# EAGLE schematic Proximity_sensor_v2 (EAGLE 9.2.0)
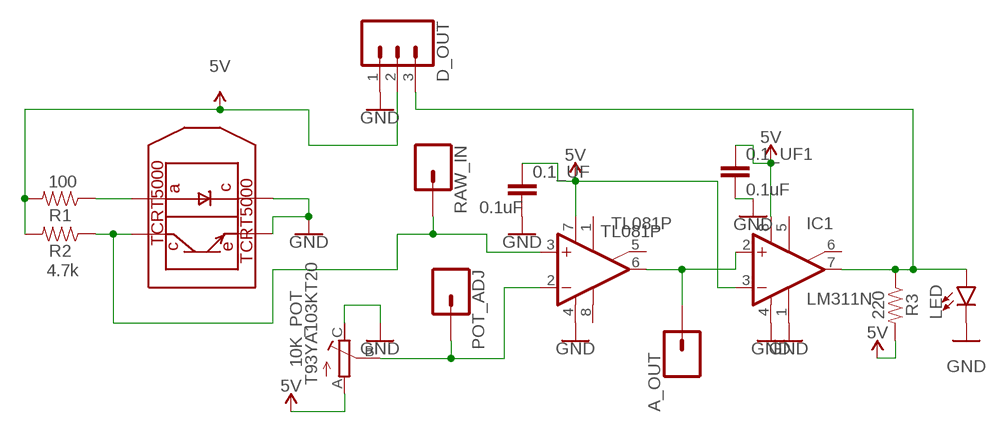
[diagram p0: schematic, sheet 1]

## Parts
0.1_UF  0.1uF  0.1UF-KIT-EZ-50V-20%  [CAP-PTH-SMALL-KIT]
0.1_UF1  0.1uF  0.1UF-KIT-EZ-50V-20%  [CAP-PTH-SMALL-KIT]
10K_POT  T93YA103KT20  [TRIM_T93YA103KT20]
A_OUT  CONN_01  [1X01]
D_OUT  CONN_03  [1X03]
IC1  LM311N  [DIL08]
LED  LED5MM  [LED_5MM]
POT_ADJ  CONN_01  [1X01]
R1  100  RESISTORAXIAL-0.3-KIT  [AXIAL-0.3-KIT]
R2  4.7k  RESISTORAXIAL-0.3-KIT  [AXIAL-0.3-KIT]
R3  220  RESISTORAXIAL-0.3-KIT  [AXIAL-0.3-KIT]
RAW_IN  CONN_01  [1X01]
TCRT5000  TCRT5000  [5000]
TL081P  TL081P  [DIL08]

## Nets
5V: 0.1_UF1.1 0.1_UF.1 10K_POT.A D_OUT.2 IC1.3(-IN) IC1.8(V+) R1.P$2 R2.P$2 R3.P$2 TL081P.7(V+)
A_OUT: A_OUT.1 IC1.2(+IN) TL081P.6(OUT)
GND: 0.1_UF1.2 0.1_UF.2 10K_POT.C D_OUT.1 IC1.1(GND) IC1.4(V-) LED.K(C) TCRT5000.P$2 TCRT5000.P$4 TL081P.4(V-)
OUTPUT: D_OUT.3 IC1.7(OUT) LED.A R3.P$1
RAW: R2.P$1 RAW_IN.1 TCRT5000.P$1 TL081P.3(+IN)
REF: 10K_POT.B POT_ADJ.1 TL081P.2(-IN)
SOURCING: R1.P$1 TCRT5000.P$3
Unconnected: IC1.5(ON) IC1.6(ON/STR) TL081P.1(ON1) TL081P.5(ON2) TL081P.8(OPT)

## Library data of the parts
0.1_UF 0.1_UF1 = SparkFun-Capacitors:0.1UF: 0.1µF ceramic capacitors A capacitor is a passive two-terminal electrical component used to store electrical energy temporarily in an electric field.; PROD_ID: CAP-08370
10K_POT = Pot-Multi-turn:T93YA103KT20: Res Cermet Trimmer 10K Ohm 10% 1/2W 21(Elec)/23(Mech)Turn 2.2mm (9.7 X 5 X 11.1mm) Pin Thru-Hole Tube; DESCRIPTION: Res Cermet Trimmer 10K Ohm 10% 1/2W 21_Elec_/23_Mech_Turn 2.2mm _9.7 X 5 X 11.1mm_ Pin Thru-Hole Tube; DIGI-KEY_PART_NUMBER: T93YA-10K-ND; DIGI-KEY_PURCHASE_URL: https://www.digikey.com/product-detail/en/vishay-sfernice/T93YA103KT20/T93YA-10K-ND/1587711?utm_source=snapeda&utm_medium=aggregator&utm_campaign=symbol; MF: Vishay; MP: T93YA103KT20; PACKAGE: TSOP-34338 Vishay
A_OUT POT_ADJ RAW_IN = SparkFun-Connectors:CONN_01: Single connection point. Often used as Generic Header-pin footprint for 0.1 inch spaced/style header connections On any of the 0.1 inch spaced packages, you can populate with these: Break Away Headers - Straight <https://www.sparkfun.com/products/116> (PRT-00116) Break Away Male Headers - Right Angle <https://www.sparkfun.com/products/553> (PRT-00553) Female Headers <https://www.sparkfun.com/products/115> (PRT-00115) Break Away Headers - Machine Pin <https://www.sparkfun.com/products/117> (PRT-00117) Break Away Female Headers - Swiss Machine Pin <https://www.sparkfun.com/products/743> (PRT-00743) This device is also useful as a general connection point to wire up your design to another part of your project. Our various solder wires solder well into these plated through hole pads. Hook-Up Wire - Assortment (Stranded, 22 AWG) <https://www.sparkfun.com/products/11375> (PRT-11375) Hook-Up Wire - Assortment (Solid Core, 22 AWG) <https://www.sparkfun.com/products/11367> (PRT-11367) View the entire wire category on our website here <https://www.sparkfun.com/categories/141> Special notes: SMTSO-256-ET is a "flush mount" nut for a 4-40 screw. We mostly use this on specialty testbeds; it is a nice way to connect hardware to your PCB at an adjustable hieght. Also note, the SNAP packages are for using a snappable style connector. We sell a baggie of snaps and they are also used on two LilyPad designs: Snap Assortment - 30 pack (male and female) <https://www.sparkfun.com/products/11347> (DEV-11347) LilyPad Arduino SimpleSnap <https://www.sparkfun.com/products/10941> (DEV-10941) LilyPad SimpleSnap Protoboard <https://www.sparkfun.com/products/10940> (DEV-10940)
D_OUT = SparkFun-Connectors:CONN_03: Multi connection point. Often used as Generic Header-pin footprint for 0.1 inch spaced/style header connections On any of the 0.1 inch spaced packages, you can populate with these: Break Away Headers - Straight <https://www.sparkfun.com/products/116> (PRT-00116) Break Away Male Headers - Right Angle <https://www.sparkfun.com/products/553> (PRT-00553) Female Headers <https://www.sparkfun.com/products/115> (PRT-00115) Break Away Headers - Machine Pin <https://www.sparkfun.com/products/117> (PRT-00117) Break Away Female Headers - Swiss Machine Pin <https://www.sparkfun.com/products/743> (PRT-00743) Stackable Header - 3 Pin (Female, 0.1") <https://www.sparkfun.com/products/13875> (PRT-13875) For SCREWTERMINALS and SPRING TERMINALS visit here: Screw Terimnals on SparkFun.com <https://www.sparkfun.com/search/results?term=Screw+Terminals> (5mm/3.5mm/2.54mm spacing) This device is also useful as a general connection point to wire up your design to another part of your project. Our various solder wires solder well into these plated through hole pads. Hook-Up Wire - Assortment (Stranded, 22 AWG) <https://www.sparkfun.com/products/11375> (PRT-11375) Hook-Up Wire - Assortment (Solid Core, 22 AWG) <https://www.sparkfun.com/products/11367> (PRT-11367) View the entire wire category on our website here <https://www.sparkfun.com/categories/141> Special notes: Molex polarized connector foot print use with SKU : PRT-08232 with associated crimp pins and housings.
IC1 = linear:LM311: COMPARATOR
LED = SparkFun-LED:LED: LED (Generic) Standard schematic elements and footprints for 5mm, 3mm, 1206, and 0603 sized LEDs. Generic LEDs with no color specified.
R1-R3 = SparkFun-Resistors:RESISTOR: Generic Resistor Package
TCRT5000 = tcrt5000:TCRT5000: Reflective Optical Sensor with Transistor Output. Vishay Semiconductors
TL081P = linear:TL081: OP AMP